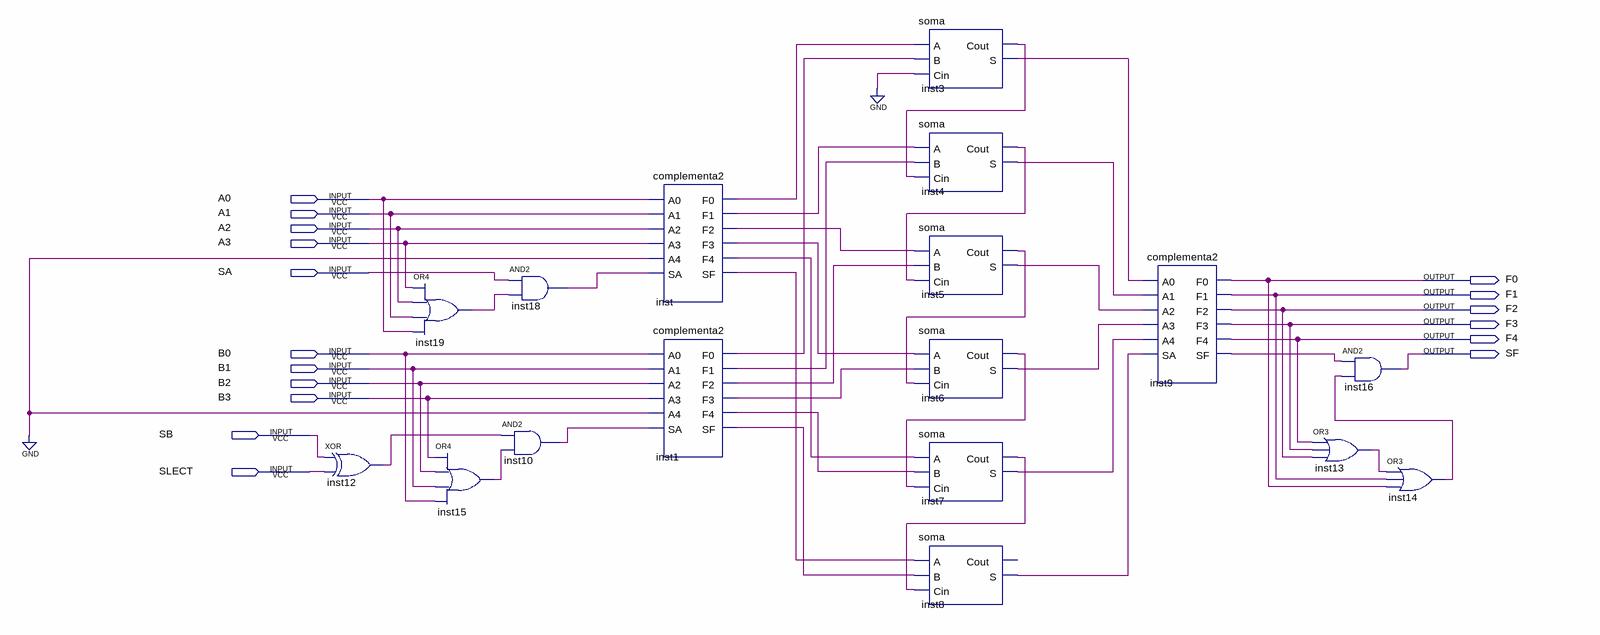
[diagram p0: schematic sheet]
// Quartus schematic somador.bdf as structural Verilog: 17 symbols, 17 pins
module somador (
  input  A0,
  input  A1,
  input  A2,
  input  A3,
  input  SA,
  input  B0,
  input  B1,
  input  B2,
  input  B3,
  input  SB,
  input  SLECT,
  output F0,
  output F1,
  output F2,
  output F3,
  output F4,
  output SF
);

  wire inst1_f0, inst1_f1, inst1_f2, inst1_f3, inst1_f4, inst1_sf, inst3_cout, inst3_s, inst4_cout, inst4_s,
       inst5_cout, inst5_s, inst6_cout, inst6_s, inst7_cout, inst7_s, inst8_s, inst9_sf, inst10_out,
       inst12_out, inst13_out, inst14_out, inst15_out, inst18_out, inst19_out, inst_f0, inst_f1, inst_f2,
       inst_f3, inst_f4, inst_sf;

  xor inst12 (inst12_out, SB, SLECT);
  or inst19 (inst19_out, A3, A2, A1, A0);
  or inst15 (inst15_out, B3, B2, B1, B0);
  and inst18 (inst18_out, SA, inst19_out);
  and inst10 (inst10_out, inst12_out, inst15_out);
  complementa2 inst (
    .A0(A0), .A1(A1), .A2(A2), .A3(A3), .A4(1'b0), .SA(inst18_out), .F0(inst_f0), .F1(inst_f1), .F2(inst_f2),
    .F3(inst_f3), .F4(inst_f4), .SF(inst_sf));
  complementa2 inst1 (
    .A0(B0), .A1(B1), .A2(B2), .A3(B3), .A4(1'b0), .SA(inst10_out), .F0(inst1_f0), .F1(inst1_f1),
    .F2(inst1_f2), .F3(inst1_f3), .F4(inst1_f4), .SF(inst1_sf));
  soma inst3 (.A(inst_f0), .B(inst1_f0), .Cin(1'b0), .Cout(inst3_cout), .S(inst3_s));
  soma inst4 (.A(inst_f1), .B(inst1_f1), .Cin(inst3_cout), .Cout(inst4_cout), .S(inst4_s));
  soma inst5 (.A(inst_f2), .B(inst1_f2), .Cin(inst4_cout), .Cout(inst5_cout), .S(inst5_s));
  soma inst6 (.A(inst_f3), .B(inst1_f3), .Cin(inst5_cout), .Cout(inst6_cout), .S(inst6_s));
  soma inst7 (.A(inst_f4), .B(inst1_f4), .Cin(inst6_cout), .Cout(inst7_cout), .S(inst7_s));
  soma inst8 (.A(inst_sf), .B(inst1_sf), .Cin(inst7_cout), .S(inst8_s));  // open: Cout
  complementa2 inst9 (
    .A0(inst3_s), .A1(inst4_s), .A2(inst5_s), .A3(inst6_s), .A4(inst7_s), .SA(inst8_s), .F0(F0), .F1(F1),
    .F2(F2), .F3(F3), .F4(F4), .SF(inst9_sf));
  or inst13 (inst13_out, F4, F3, F2);
  and inst16 (SF, inst9_sf, inst14_out);
  or inst14 (inst14_out, inst13_out, F1, F0);
endmodule
